# EAGLE schematic Longboard (EAGLE 9.1.3)

## Sheet 1 of 3
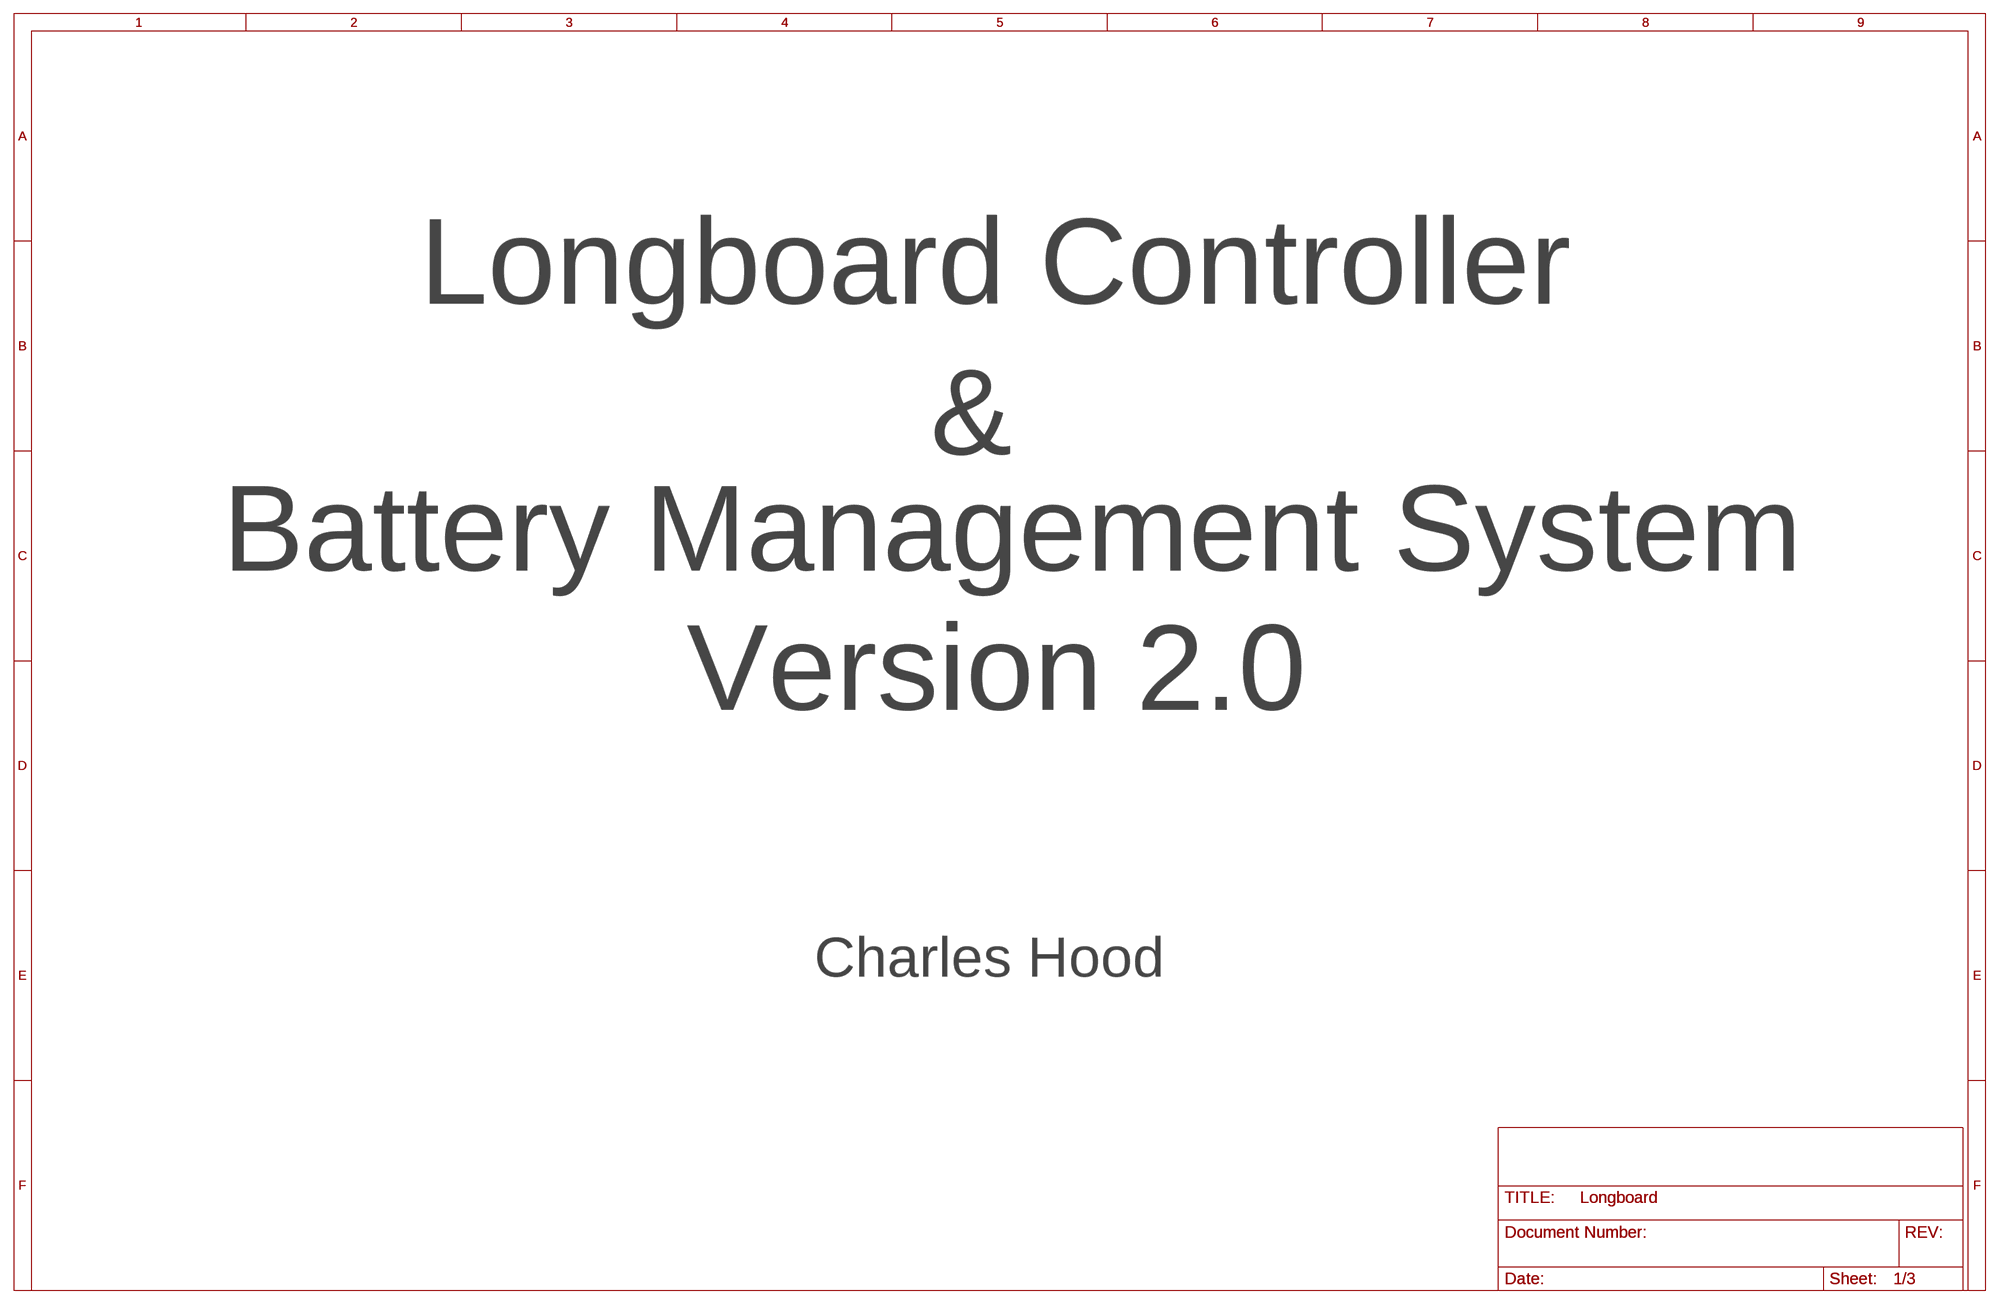
[diagram p0: schematic, sheet 1]

### Notes on the sheet
- Longboard Controller
- &
- Battery Management System
- Version 2.0
- Charles Hood

## Sheet 2 of 3
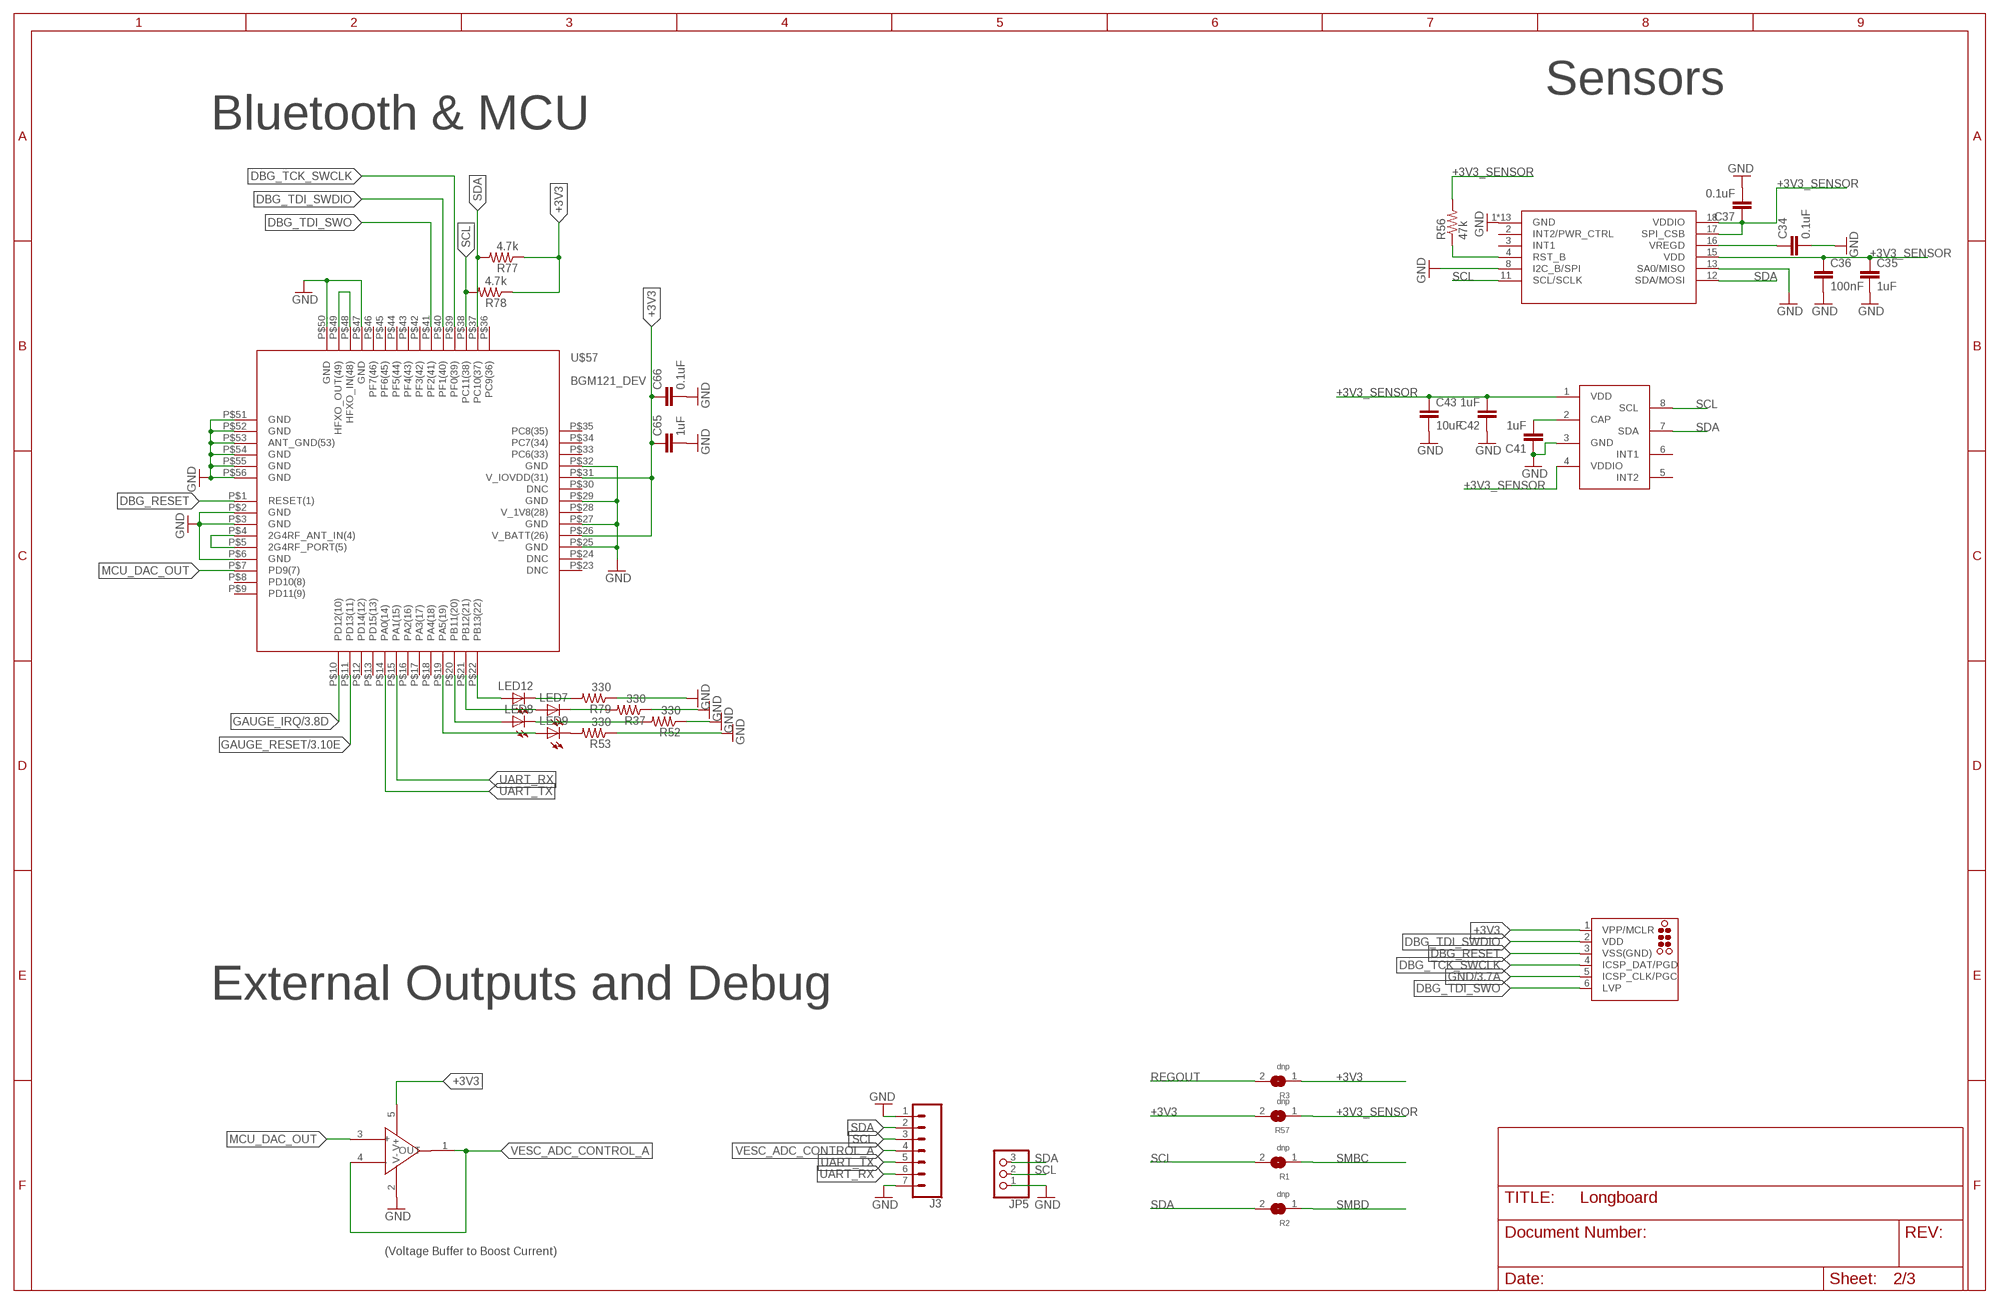
[diagram p1: schematic, sheet 2]

### Parts
C34  0.1uF  C-EUC0402  [C0402]
C35  1uF  C-EUC0402  [C0402]
C36  100nF  C-EUC0402  [C0402]
C37  0.1uF  C-EUC0402  [C0402]
C41  1uF  C-EUC0402  [C0402]
C42  1uF  C-EUC0402  [C0402]
C43  10uF  C-EUC0603  [C0603]
C65  1uF  C-EUC0402  [C0402]
C66  0.1uF  C-EUC0402  [C0402]
J2  TC2030-MCP-NL  [TC2030-MCP-NL]
J3  CONN_07  [1X07]
JP5  PINHD-1X3  [1X03]
LED7  LEDCHIP-LED0603  [CHIP-LED0603]
LED8  LEDCHIP-LED0603  [CHIP-LED0603]
LED9  LEDCHIP-LED0603  [CHIP-LED0603]
LED12  LEDCHIP-LED0603  [CHIP-LED0603]
R1  dnp  SOLDERJUMPER  [SOLDERJUMPER_ARROW_NOPASTE]
R2  dnp  SOLDERJUMPER  [SOLDERJUMPER_ARROW_NOPASTE]
R3  dnp  SOLDERJUMPER  [SOLDERJUMPER_ARROW_NOPASTE]
R37  330  R-US_R0402  [R0402]
R52  330  R-US_R0402  [R0402]
R53  330  R-US_R0402  [R0402]
R56  47k  R-US_R0402  [R0402]
R57  dnp  SOLDERJUMPER  [SOLDERJUMPER_ARROW_NOPASTE]
R77  4.7k  R-US_R0402  [R0402]
R78  4.7k  R-US_R0402  [R0402]
R79  330  R-US_R0402  [R0402]
U$5  MCP6001  [SOT23-5L]
U$25  MLP3115A2  [MLP3115A2]
U$34  FXAS21002  [FXAS21002]
U$57  BGM121_DEV  [BGM121_PAC]

### Nets
+3V3: C65.1 C66.1 J2.1(VPP/MCLR) R3.1 R57.2 R77.1 R78.1 U$5.5(V+) U$57.P$26(V_BATT(26)) U$57.P$31(V_IOVDD(31))
+3V3_SENSOR: C35.1 C36.1 C37.1 C42.2 C43.1 R56.2 R57.1 U$25.1(VDD) U$25.4(VDDIO) U$34.15(VDD) U$34.17(SPI_CSB) U$34.18(VDDIO)
DBG_RESET: J2.3(VSS(GND)) U$57.P$1(RESET(1))
DBG_TCK_SWCLK: J2.4(ICSP_DAT/PGD) U$57.P$39(PF0(39))
DBG_TDI_SWDIO: J2.2(VDD) U$57.P$40(PF1(40))
DBG_TDI_SWO: J2.6(LVP) U$57.P$41(PF2(41))
GAUGE_IRQ: U$57.P$10(PD12(10)) ; also sheet 3
GAUGE_RESET: U$57.P$11(PD13(11)) ; also sheet 3
GND: C34.2 C35.2 C36.2 C37.2 C41.1 C42.1 C43.2 C65.2 C66.2 J2.5(ICSP_CLK/PGC) J3.1 J3.7 JP5.1 R37.1 R52.1 R53.1 R79.1 U$5.2(V-) U$25.3(GND) U$34.1(GND) U$34.5(GND) U$34.6(GND) U$34.7(GND) U$34.9(GND) U$34.10(GND) U$34.13(SA0/MISO) U$34.14(GND) U$34.19(GND) U$34.20(GND) U$34.21(GND) U$34.22(GND) U$34.23(GND) U$34.24(GND) U$57.P$2(GND) U$57.P$3(GND) U$57.P$6(GND) U$57.P$25(GND) U$57.P$27(GND) U$57.P$29(GND) U$57.P$32(GND) U$57.P$47(GND) U$57.P$50(GND) U$57.P$51(GND) U$57.P$52(GND) U$57.P$53(ANT_GND(53)) U$57.P$54(GND) U$57.P$55(GND) U$57.P$56(GND) ; also sheet 3
MCU_DAC_OUT: U$5.3(+) U$57.P$7(PD9(7))
N$1: LED12.A U$57.P$22(PB13(22))
N$2: LED7.A U$57.P$21(PB12(21))
N$3: LED8.A U$57.P$20(PB11(20))
N$4: LED9.A U$57.P$19(PA5(19))
N$13: U$34.8(I2C_B/SPI) ; supply symbol labelled GND
N$30: R56.1 U$34.4(RST_B)
N$36: LED7.C R37.2
N$42: LED8.C R52.2
N$74: LED9.C R53.2
N$78: C34.1 U$34.16(VREGD)
N$81: C41.2 U$25.2(CAP)
N$110: U$57.P$4(2G4RF_ANT_IN(4)) U$57.P$5(2G4RF_PORT(5))
N$112: LED12.C R79.2
N$113: U$57.P$48(HFXO_IN(48)) U$57.P$49(HFXO_OUT(49))
REGOUT: R3.2 ; also sheet 3
SCL: J3.3 JP5.2 R1.2 R78.2 U$25.8(SCL) U$34.11(SCL/SCLK) U$57.P$38(PC11(38))
SDA: J3.2 JP5.3 R2.2 R77.2 U$25.7(SDA) U$34.12(SDA/MOSI) U$57.P$37(PC10(37))
SMBC: R1.1 ; also sheet 3
SMBD: R2.1 ; also sheet 3
UART_RX: J3.6 U$57.P$15(PA1(15))
UART_TX: J3.5 U$57.P$14(PA0(14))
VESC_ADC_CONTROL_A: J3.4 U$5.1(OUT) U$5.4(-)
Unconnected: U$25.5(INT2) U$25.6(INT1) U$34.2(INT2/PWR_CTRL) U$34.3(INT1) U$57.P$8(PD10(8)) U$57.P$9(PD11(9)) U$57.P$12(PD14(12)) U$57.P$13(PD15(13)) U$57.P$16(PA2(16)) U$57.P$17(PA3(17)) U$57.P$18(PA4(18)) U$57.P$23(DNC) U$57.P$24(DNC) U$57.P$30(DNC) U$57.P$33(PC6(33)) U$57.P$34(PC7(34)) U$57.P$35(PC8(35)) U$57.P$36(PC9(36)) U$57.P$42(PF3(42)) U$57.P$43(PF4(43)) U$57.P$44(PF5(44)) U$57.P$45(PF6(45)) U$57.P$46(PF7(46))

### Notes on the sheet
- Sensors
- Bluetooth & MCU
- External Outputs and Debug
- (Voltage Buffer to Boost Current)

## Sheet 3 of 3
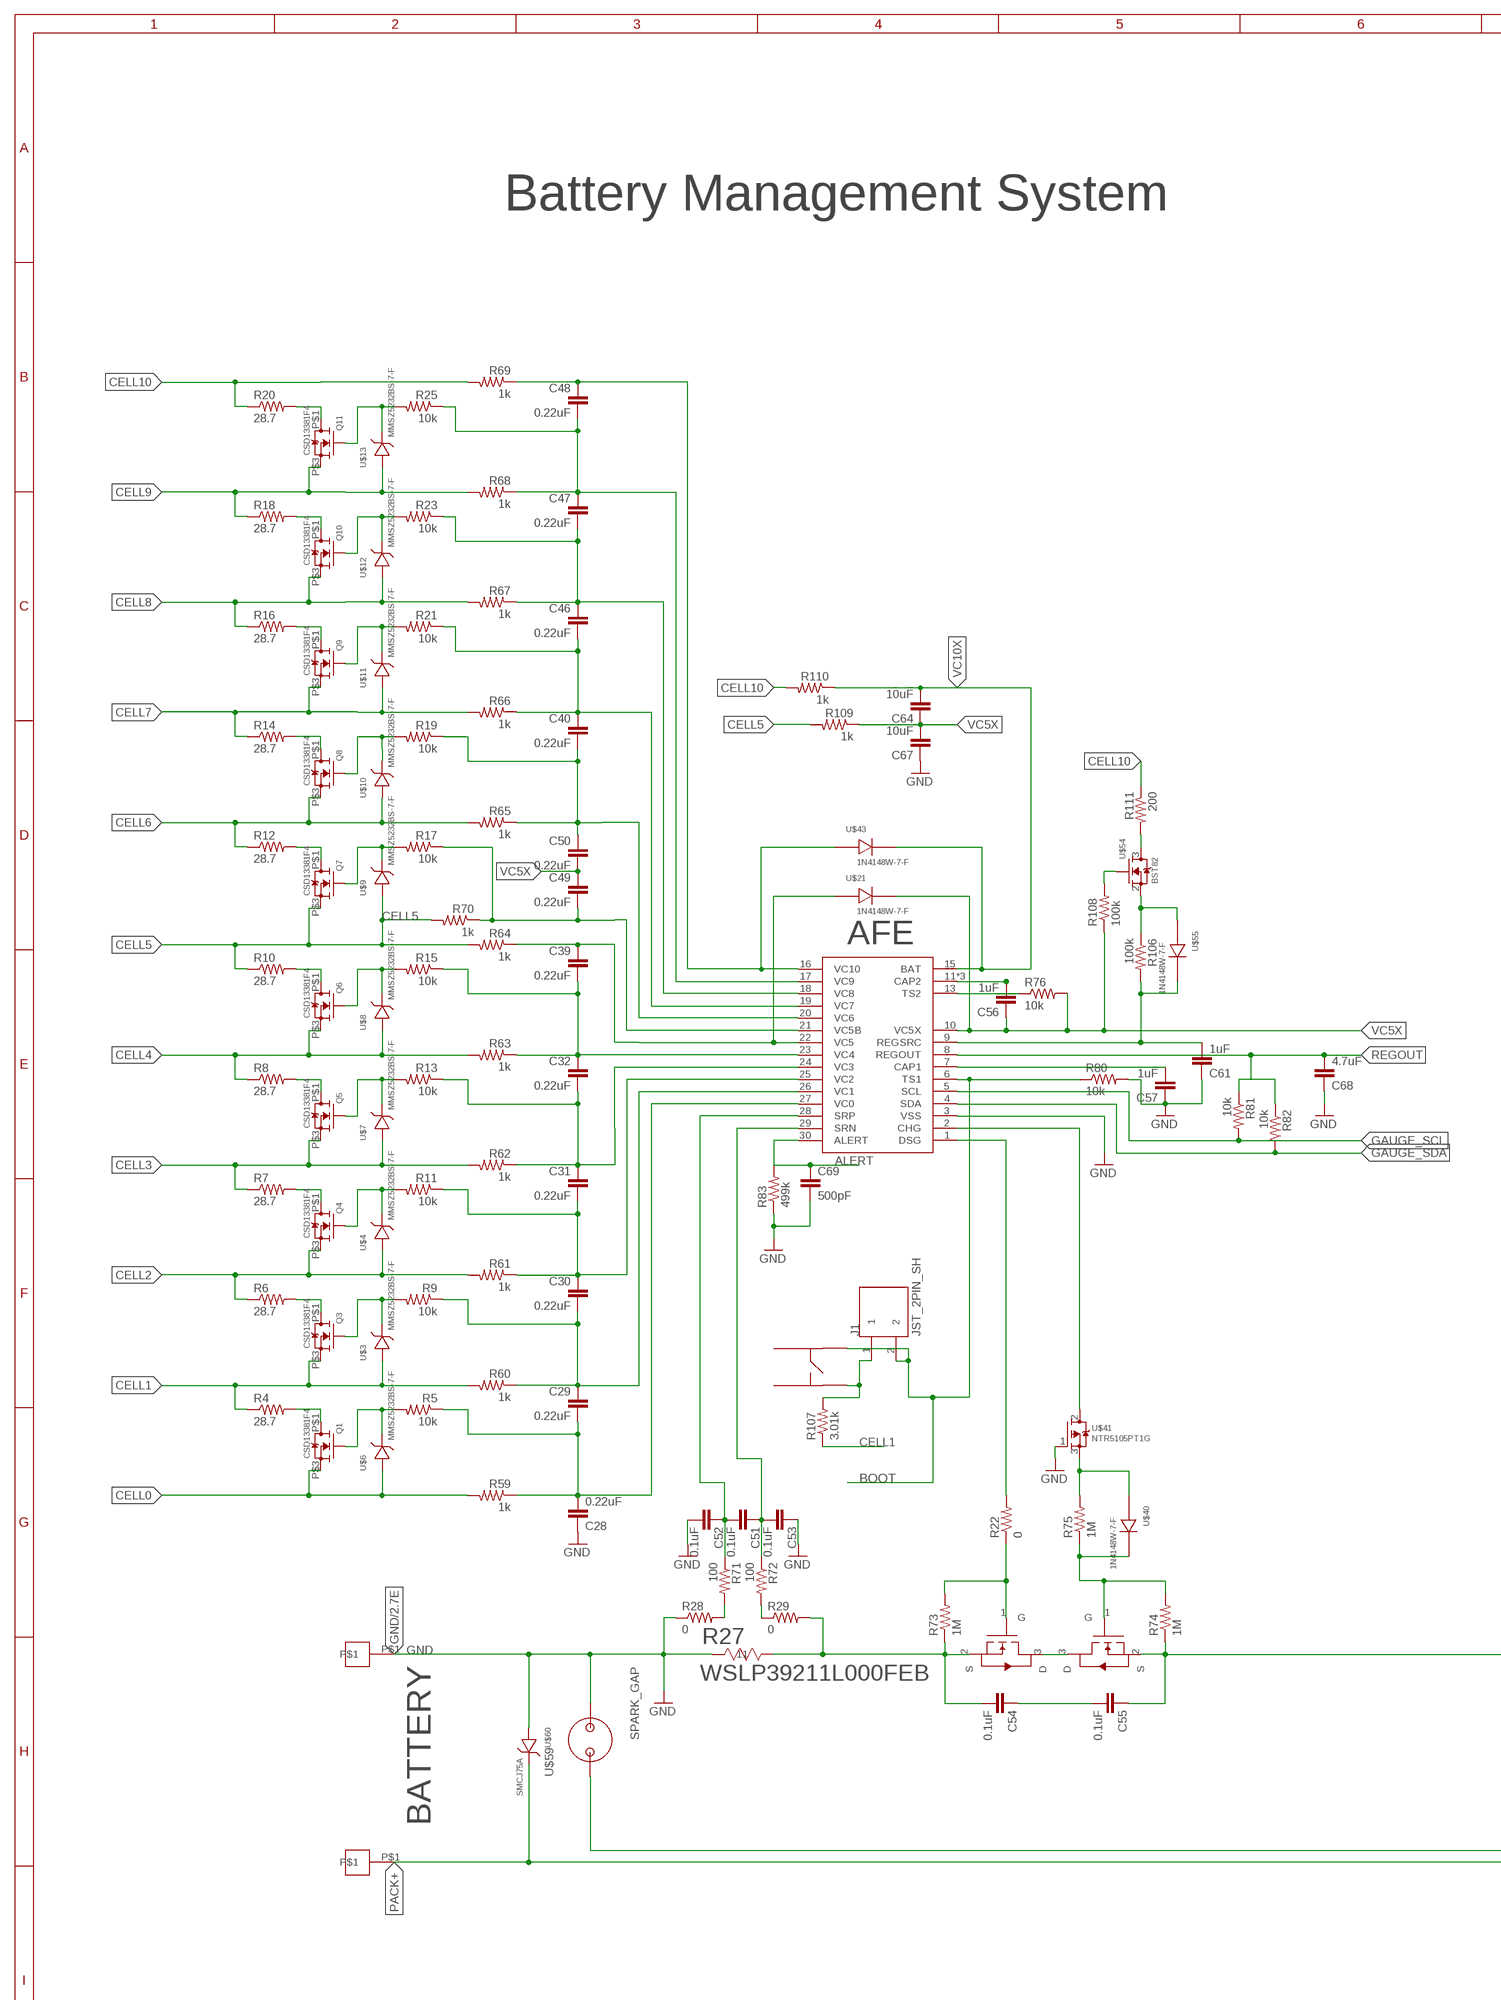
[diagram p2: schematic, sheet 3, part 1 of 2]
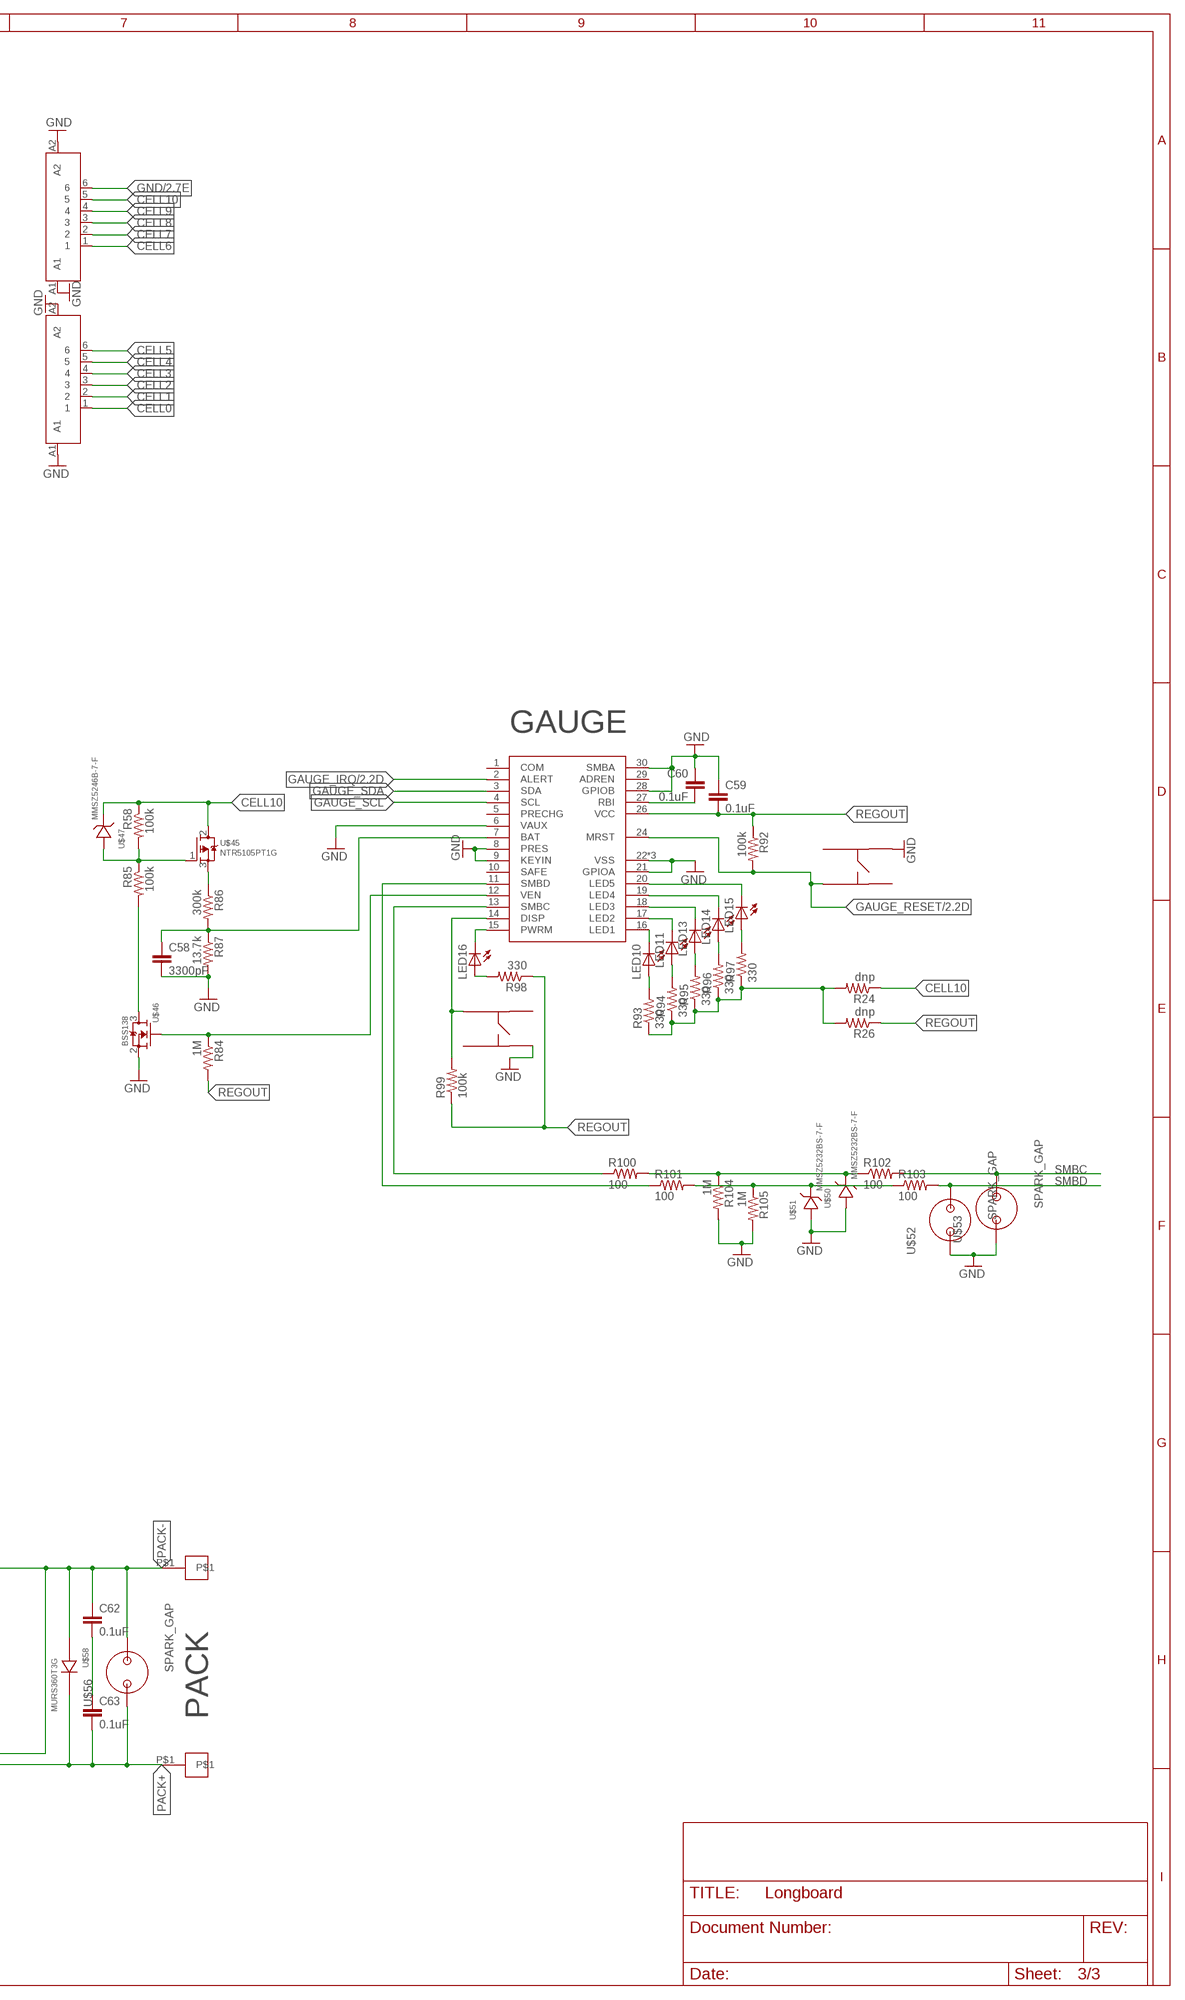
[diagram p3: schematic, sheet 3, part 2 of 2]

### Parts
C28  0.22uF  C-EUC0805  [C0805]
C29  0.22uF  C-EUC0805  [C0805]
C30  0.22uF  C-EUC0805  [C0805]
C31  0.22uF  C-EUC0805  [C0805]
C32  0.22uF  C-EUC0805  [C0805]
C39  0.22uF  C-EUC0805  [C0805]
C40  0.22uF  C-EUC0805  [C0805]
C46  0.22uF  C-EUC0805  [C0805]
C47  0.22uF  C-EUC0805  [C0805]
C48  0.22uF  C-EUC0805  [C0805]
C49  0.22uF  C-EUC0805  [C0805]
C50  0.22uF  C-EUC0805  [C0805]
C51  0.1uF  C-EUC0805  [C0805]
C52  0.1uF  C-EUC0805  [C0805]
C53  0.1uF  C-EUC0805  [C0805]
C54  0.1uF  C-EUC0805  [C0805]
C55  0.1uF  C-EUC0805  [C0805]
C56  1uF  C-EUC0805  [C0805]
C57  1uF  C-EUC0805  [C0805]
C58  3300pF  C-EUC0402  [C0402]
C59  0.1uF  C-EUC0805  [C0805]
C60  0.1uF  C-EUC0805  [C0805]
C61  1uF  C-EUC0805  [C0805]
C62  0.1uF  C-EUC0805  [C0805]
C63  0.1uF  C-EUC0805  [C0805]
C64  10uF  C-EUC1210  [C1210]
C67  10uF  C-EUC1210  [C1210]
C68  4.7uF  C-EUC0805  [C0805]
C69  500pF  C-EUC0603  [C0603]
J1  JST_2PIN_SH  [JST_2PIN_SH]
LED10  LEDCHIPLED_0603  [CHIPLED_0603]
LED11  LEDCHIPLED_0603  [CHIPLED_0603]
LED13  LEDCHIPLED_0603  [CHIPLED_0603]
LED14  LEDCHIPLED_0603  [CHIPLED_0603]
LED15  LEDCHIPLED_0603  [CHIPLED_0603]
LED16  LEDCHIPLED_0603  [CHIPLED_0603]
Q1  CSD13381F4  [3-XFDFN]
Q3  CSD13381F4  [3-XFDFN]
Q4  CSD13381F4  [3-XFDFN]
Q5  CSD13381F4  [3-XFDFN]
Q6  CSD13381F4  [3-XFDFN]
Q7  CSD13381F4  [3-XFDFN]
Q8  CSD13381F4  [3-XFDFN]
Q9  CSD13381F4  [3-XFDFN]
Q10  CSD13381F4  [3-XFDFN]
Q11  CSD13381F4  [3-XFDFN]
R4  28.7  R-US_R2010  [R2010]
R5  10k  R-US_R1206  [R1206]
R6  28.7  R-US_R2010  [R2010]
R7  28.7  R-US_R2010  [R2010]
R8  28.7  R-US_R2010  [R2010]
R9  10k  R-US_R1206  [R1206]
R10  28.7  R-US_R2010  [R2010]
R11  10k  R-US_R1206  [R1206]
R12  28.7  R-US_R2010  [R2010]
R13  10k  R-US_R1206  [R1206]
R14  28.7  R-US_R2010  [R2010]
R15  10k  R-US_R1206  [R1206]
R16  28.7  R-US_R2010  [R2010]
R17  10k  R-US_R1206  [R1206]
R18  28.7  R-US_R2010  [R2010]
R19  10k  R-US_R1206  [R1206]
R20  28.7  R-US_R2010  [R2010]
R21  10k  R-US_R1206  [R1206]
R22  0  R-US_R1206  [R1206]
R23  10k  R-US_R1206  [R1206]
R24  dnp  R-US_R0402  [R0402]
R25  10k  R-US_R1206  [R1206]
R26  dnp  R-US_R0402  [R0402]
R27  WSLP39211L000FEB  [W-3921]
R28  0  R-US_R0402  [R0402]
R29  0  R-US_R0402  [R0402]
R58  100k  R-US_R0805  [R0805]
R59  1k  R-US_R1206  [R1206]
R60  1k  R-US_R1206  [R1206]
R61  1k  R-US_R1206  [R1206]
R62  1k  R-US_R1206  [R1206]
R63  1k  R-US_R1206  [R1206]
R64  1k  R-US_R1206  [R1206]
R65  1k  R-US_R1206  [R1206]
R66  1k  R-US_R1206  [R1206]
R67  1k  R-US_R1206  [R1206]
R68  1k  R-US_R1206  [R1206]
R69  1k  R-US_R1206  [R1206]
R70  1k  R-US_R1206  [R1206]
R71  100  R-US_R0805  [R0805]
R72  100  R-US_R0805  [R0805]
R73  1M  R-US_R1206  [R1206]
R74  1M  R-US_R1206  [R1206]
R75  1M  R-US_R1206  [R1206]
R76  10k  R-US_R0805  [R0805]
R80  10k  R-US_R0805  [R0805]
R81  10k  R-US_R0805  [R0805]
R82  10k  R-US_R0805  [R0805]
R83  499k  R-US_R0603  [R0603]
R84  1M  R-US_R1206  [R1206]
R85  100k  R-US_R0805  [R0805]
R86  300k  R-US_R0805  [R0805]
R87  13.7k  R-US_R0805  [R0805]
R92  100k  R-US_R0805  [R0805]
R93  330  R-US_R0402  [R0402]
R94  330  R-US_R0402  [R0402]
R95  330  R-US_R0402  [R0402]
R96  330  R-US_R0402  [R0402]
R97  330  R-US_R0402  [R0402]
R98  330  R-US_R0402  [R0402]
R99  100k  R-US_R0402  [R0402]
R100  100  R-US_R0805  [R0805]
R101  100  R-US_R0805  [R0805]
R102  100  R-US_R0805  [R0805]
R103  100  R-US_R0805  [R0805]
R104  1M  R-US_R1206  [R1206]
R105  1M  R-US_R1206  [R1206]
R106  100k  R-US_R0805  [R0805]
R107  3.01k  R-US_R1206  [R1206]
R108  100k  R-US_R0805  [R0805]
R109  1k  R-US_R1206  [R1206]
R110  1k  R-US_R1206  [R1206]
R111  200  R-US_R1206  [R1206]
S1  KMR731NG  [KMR731NG]
S2  KMR731NG  [KMR731NG]
S3  KMR731NG  [KMR731NG]
U$3  MMSZ5232BS-7-F  [SOD-323F]
U$4  MMSZ5232BS-7-F  [SOD-323F]
U$6  MMSZ5232BS-7-F  [SOD-323F]
U$7  MMSZ5232BS-7-F  [SOD-323F]
U$8  MMSZ5232BS-7-F  [SOD-323F]
U$9  MMSZ5232BS-7-F  [SOD-323F]
U$10  MMSZ5232BS-7-F  [SOD-323F]
U$11  MMSZ5232BS-7-F  [SOD-323F]
U$12  MMSZ5232BS-7-F  [SOD-323F]
U$13  MMSZ5232BS-7-F  [SOD-323F]
U$14  PAD  [PAD]
U$15  PAD  [PAD]
U$16  PAD  [PAD]
U$17  PAD  [PAD]
U$18  JST_6PIN  [JST_6PIN]
U$19  JST_6PIN  [JST_6PIN]
U$20  BQ76930  [SOIC-30]
U$21  1N4148W-7-F  [SOD-123]
U$22  AOB290L  [TO-263]
U$23  AOB290L  [TO-263]
U$40  1N4148W-7-F  [SOD-123]
U$41  NTR5105PT1G  BSS84PH6433XTMA1  [SOT23-3]
U$43  1N4148W-7-F  [SOD-123]
U$44  BQ78350-R1  [SOIC-30]
U$45  NTR5105PT1G  BSS84PH6433XTMA1  [SOT23-3]
U$46  BSS138  [SOT23-3]
U$47  MMSZ5246B-7-F  [SOD-123]
U$50  MMSZ5232BS-7-F  [SOD-323F]
U$51  MMSZ5232BS-7-F  [SOD-323F]
U$52  SPARK_GAP  [SPARK_GAP]
U$53  SPARK_GAP  [SPARK_GAP]
U$54  BST82  [SOT23-3]
U$55  1N4148W-7-F  [SOD-123]
U$56  SPARK_GAP  [SPARK_GAP]
U$58  MURS360T3G  [SMC(DO-214AB)]
U$59  SPARK_GAP  [SPARK_GAP]
U$60  SMCJ75A  SMCJ28A  [SMC(DO-214AB)]

### Nets
ALERT: C69.1 R83.2 U$20.30(ALERT)
BOOT: J1.2 R80.1 S1.P$2 U$20.6(TS1)
CELL0: Q1.P$3(S) R59.2 U$6.1 U$19.1
CELL1: Q3.P$3(S) R4.1 R60.2 R107.1 U$3.1 U$19.2
CELL2: Q4.P$3(S) R6.1 R61.2 U$4.1 U$19.3
CELL3: Q5.P$3(S) R7.1 R62.2 U$7.1 U$19.4
CELL4: Q6.P$3(S) R8.1 R63.2 U$8.1 U$19.5
CELL5: Q7.P$3(S) R10.1 R64.2 R70.2 R109.2 U$9.1 U$19.6
CELL6: Q8.P$3(S) R12.1 R65.2 U$10.1 U$18.1
CELL7: Q9.P$3(S) R14.1 R66.2 U$11.1 U$18.2
CELL8: Q10.P$3(S) R16.1 R67.2 U$12.1 U$18.3
CELL9: Q11.P$3(S) R18.1 R68.2 U$13.1 U$18.4
CELL10: R20.1 R24.1 R58.1 R69.2 R110.2 R111.1 U$18.5 U$45.2(S) U$47.P$2
GAUGE_IRQ: U$44.2(ALERT) ; also sheet 2
GAUGE_RESET: R92.2 S3.P$4 U$44.24(MRST) ; also sheet 2
GAUGE_SCL: R81.2 U$20.5(SCL) U$44.4(SCL)
GAUGE_SDA: R82.2 U$20.4(SDA) U$44.3(SDA)
GND: C28.1 C52.2 C53.1 C57.1 C58.2 C59.1 C60.1 C61.1 C67.1 C68.1 C69.2 R27.1 R28.1 R80.2 R83.1 R87.2 R104.2 R105.2 S2.P$3 S3.P$2 U$17.P$1 U$18.6 U$18.A1 U$18.A2 U$19.A1 U$19.A2 U$20.3(VSS) U$41.1(G) U$44.6(VAUX) U$44.8(PRES) U$44.9(KEYIN) U$44.21(GPIOA) U$44.22(VSS) U$44.23(VSS) U$44.25(VSS) U$44.28(GPIOB) U$44.30(SMBA) U$46.2(S) U$50.1 U$51.1 U$52.P$1 U$53.P$1 U$59.P$2 U$60.1 ; also sheet 2
N$5: R28.2 R71.2
N$6: R29.1 R72.2
N$7: Q1.P$1(D) R4.2
N$8: Q8.P$2(G) R19.2 U$10.2
N$9: Q1.P$2(G) R5.2 U$6.2
N$10: Q3.P$1(D) R6.2
N$11: Q3.P$2(G) R9.2 U$3.2
N$12: R22.2 U$20.1(DSG)
N$14: Q5.P$1(D) R8.2
N$15: Q4.P$1(D) R7.2
N$16: Q4.P$2(G) R11.2 U$4.2
N$17: Q5.P$2(G) R13.2 U$7.2
N$18: Q6.P$2(G) R15.2 U$8.2
N$19: Q8.P$1(D) R14.2
N$20: C40.2 C50.1 R19.1 R65.1 U$20.20(VC6)
N$21: C49.2 R17.1 R70.1 U$20.21(VC5B)
N$22: R24.2 R26.2 R93.1 R94.1 R95.1 R96.1 R97.1
N$23: Q6.P$1(D) R10.2
N$26: Q7.P$1(D) R12.2
N$27: Q7.P$2(G) R17.2 U$9.2
N$28: Q9.P$1(D) R16.2
N$32: Q10.P$1(D) R18.2
N$33: Q11.P$1(D) R20.2
N$34: Q11.P$2(G) R25.2 U$13.2
N$35: Q10.P$2(G) R23.2 U$12.2
N$37: Q9.P$2(G) R21.2 U$11.2
N$75: C29.1 C30.2 R9.1 R60.1 U$20.26(VC1)
N$76: C30.1 C31.2 R11.1 R61.1 U$20.25(VC2)
N$77: C31.1 C32.2 R13.1 R62.1 U$20.24(VC3)
N$79: C32.1 C39.2 R15.1 R63.1 U$20.23(VC4)
N$80: C39.1 R64.1 U$20.22(VC5) U$21.P$1
N$82: C40.1 C46.2 R21.1 R66.1 U$20.19(VC7)
N$83: C46.1 C47.2 R23.1 R67.1 U$20.18(VC8)
N$84: C47.1 C48.2 R25.1 R68.1 U$20.17(VC9)
N$85: C48.1 R69.1 U$20.16(VC10) U$43.P$1
N$86: C28.2 C29.2 R5.1 R59.1 U$20.27(VC0)
N$97: C51.1 C53.2 R72.1 U$20.29(SRN)
N$98: C51.2 C52.1 R71.1 U$20.28(SRP)
N$99: C54.2 R27.2 R29.2 R73.1 U$22.2(S)
N$100: U$22.3(D) U$23.3(D)
N$101: R74.2 R75.1 U$23.1(G) U$40.P$2
N$102: R75.2 U$40.P$1 U$41.3(D)
N$103: U$20.2(CHG) U$41.2(S)
N$104: C54.1 C55.2
N$105: C56.2 U$20.11(CAP2) U$20.12(CAP2) U$20.14(CAP2)
N$106: R76.1 U$20.13(TS2)
N$107: C57.2 U$20.7(CAP1)
N$108: R84.1 U$44.12(VEN) U$46.1(G)
N$109: R85.2 U$46.3(D)
N$114: R58.2 R85.1 U$45.1(G) U$47.P$1
N$115: R86.1 U$45.3(D)
N$116: C58.1 R86.2 R87.1 U$44.7(BAT)
N$122: C60.2 U$44.27(RBI)
N$124: LED10.A R93.2
N$125: LED11.A R94.2
N$126: LED13.A R95.2
N$127: LED14.A R96.2
N$128: LED15.A R97.2
N$129: LED10.C U$44.16(LED1)
N$130: LED11.C U$44.17(LED2)
N$131: LED13.C U$44.18(LED3)
N$132: LED14.C U$44.19(LED4)
N$133: LED15.C U$44.20(LED5)
N$134: LED16.A R98.2
N$135: R99.2 S2.P$1 U$44.14(DISP)
N$136: LED16.C U$44.15(PWRM)
N$138: R101.1 U$44.11(SMBD)
N$139: R100.1 U$44.13(SMBC)
N$140: R100.2 R102.1 R104.1 U$50.2
N$141: R101.2 R103.1 R105.1 U$51.2
N$142: R106.1 U$54.2(S) U$55.P$1
N$143: R111.2 U$54.3(D)
N$144: R22.1 R73.2 U$22.1(G)
N$145: J1.1 R107.2 S1.P$3
N$146: C62.2 C63.1
N$147: R108.2 U$54.1(G)
PACK+: C63.2 U$15.P$1 U$16.P$1 U$56.P$1 U$58.2 U$60.2
PACK-: C55.1 C62.1 R74.1 U$14.P$1 U$23.2(S) U$56.P$2 U$58.1 U$59.P$1
REGOUT: C59.2 C68.2 R26.1 R81.1 R82.1 R84.2 R92.1 R98.1 R99.1 U$20.8(REGOUT) U$44.26(VCC) ; also sheet 2
REGSRC: C61.2 R106.2 U$20.9(REGSRC) U$55.P$2
SMBC: R102.2 U$53.P$2 ; also sheet 2
SMBD: R103.2 U$52.P$2 ; also sheet 2
VC5X: C49.1 C50.2 C56.1 C64.1 C67.2 R76.2 R108.1 R109.1 U$20.10(VC5X) U$21.P$2
VC10X: C64.2 R110.1 U$20.15(BAT) U$43.P$2
Unconnected: S1.P$1 S1.P$4 S2.P$2 S2.P$4 S3.P$1 S3.P$3 U$44.1(COM) U$44.5(PRECHG) U$44.10(SAFE) U$44.29(ADREN)

### Notes on the sheet
- Battery Management System
- GAUGE
- AFE
- PACK
- BATTERY

## Power pins joined to a net without a drawn wire
V_1V8(28): U$57.P$28(V_1V8(28))

## Library data of the parts
C28-C32 C34-C37 C39-C43 C46-C64 C67-C69 = rcl:C-EU: CAPACITOR, European symbol
C65 C66 = rcl:C-EU: CAPACITOR, European symbol; SPICEPREFIX: C
J1 = James_Updated:JST_2PIN_SH: 1mm pitch SMD 2 pin Right Angle JST Header / Connector. Typically used for battery connectors. https://www.digikey.com/product-detail/en/jst-sales-america-inc/SM02B-SRSS-TB-LF-SN/455-1802-1-ND/926873
J2 = Tag-Connect-Footprints:TC2030: TAG-CONNECT ICSP Connector Manufacturer: Tag-Connect <http://www.tag-connect.com> Cable for easy In-Circuit Serial Programming. Designed for Microchip ICD2, suitable for many others. Two variants - one "with legs" (for hands-free fit on PCB) and another "without legs" for quick programming. PAD Description 1 MCLR/Vpp 2 Vdd 3 GND 4 PGD (ISPDAT) 5 PGC (ISPCLK) 6 nc (used for LVP) ©2009 ROFA.cz - modified and updated by Robert Darlington ‹rdarlington@gmail.com›
J3 = SparkFun-Connectors:CONN_07: Multi connection point. Often used as Generic Header-pin footprint for 0.1 inch spaced/style header connections On any of the 0.1 inch spaced packages, you can populate with these: Break Away Headers - Straight <https://www.sparkfun.com/products/116> (PRT-00116) Break Away Male Headers - Right Angle <https://www.sparkfun.com/products/553> (PRT-00553) Female Headers <https://www.sparkfun.com/products/115> (PRT-00115) Break Away Headers - Machine Pin <https://www.sparkfun.com/products/117> (PRT-00117) Break Away Female Headers - Swiss Machine Pin <https://www.sparkfun.com/products/743> (PRT-00743) For SCREWTERMINALS and SPRING TERMINALS visit here: Screw Terimnals on SparkFun.com <https://www.sparkfun.com/search/results?term=Screw+Terminals> (5mm/3.5mm/2.54mm spacing) This device is also useful as a general connection point to wire up your design to another part of your project. Our various solder wires solder well into these plated through hole pads. Hook-Up Wire - Assortment (Stranded, 22 AWG) <https://www.sparkfun.com/products/11375> (PRT-11375) Hook-Up Wire - Assortment (Solid Core, 22 AWG) <https://www.sparkfun.com/products/11367> (PRT-11367) View the entire wire category on our website here <https://www.sparkfun.com/categories/141> Special notes: Molex polarized connector foot print use with SKU : PRT-08231 with associated crimp pins and housings. 1MM SMD Version SKU: PRT-10208 NOTES ON THE VARIANTS LOCK and LOCK_LONGPADS... This footprint was designed to help hold the alignment of a through-hole component (i.e. 6-pin header) while soldering it into place. You may notice that each hole has been shifted either up or down by 0.005 of an inch from it's more standard position (which is a perfectly straight line). This slight alteration caused the pins (the squares in the middle) to touch the edges of the holes. Because they are alternating, it causes a "brace" to hold the component in place. 0.005 has proven to be the perfect amount of "off-center" position when using our standard breakaway headers. Although looks a little odd when you look at the bare footprint, once you have a header in there, the alteration is very hard to notice. Also,if you push a header all the way into place, it is covered up entirely on the bottom side.
JP5 = pinhead:PINHD-1X3: PIN HEADER
LED7-LED16 = adafruit:LED: LED OSRAM: - CHIPLED LG R971, LG N971, LY N971, LG Q971, LY Q971, LO R971, LY R971 LH N974, LH R974 LS Q976, LO Q976, LY Q976 LO Q996 - Hyper CHIPLED LW Q18S LB Q993, LB Q99A, LB R99A - SideLED LS A670, LO A670, LY A670, LG A670, LP A670 LB A673, LV A673, LT A673, LW A673 LH A674 LY A675 LS A676, LA A676, LO A676, LY A676, LW A676 LS A679, LY A679, LG A679 - Hyper Micro SIDELED® LS Y876, LA Y876, LO Y876, LY Y876 LT Y87S - SmartLED LW L88C, LW L88S LB L89C, LB L89S, LG L890 LS L89K, LO L89K, LY L89K LS L896, LA L896, LO L896, LY L896 - TOPLED LS T670, LO T670, LY T670, LG T670, LP T670 LSG T670, LSP T670, LSY T670, LOP T670, LYG T670 LG T671, LOG T671, LSG T671 LB T673, LV T673, LT T673, LW T673 LH T674 LS T676, LA T676, LO T676, LY T676, LB T676, LH T676, LSB T676, LW T676 LB T67C, LV T67C, LT T67C, LS T67K, LO T67K, LY T67K, LW E67C LS E67B, LA E67B, LO E67B, LY E67B, LB E67C, LV E67C, LT E67C LW T67C LS T679, LY T679, LG T679 LS T770, LO T770, LY T770, LG T770, LP T770 LB T773, LV T773, LT T773, LW T773 LH T774 LS E675, LA E675, LY E675, LS T675 LS T776, LA T776, LO T776, LY T776, LB T776 LHGB T686 LT T68C, LB T68C - Hyper Mini TOPLED® LB M676 - Mini TOPLED Santana® LG M470 LS M47K, LO M47K, LY M47K Source: http://www.osram.convergy.de/
Q1 Q3-Q11 = Charles:CSD13381F4: CSD13381F412VN-Channel FemtoFET MOSFET (ID 2.1A, IDM 7A)
R1-R3 R57 = Charles:SOLDERJUMPER: SMD Solder JUMPER Solder the two pads together to create a connection, or remove the solder to break it. REFLOW - Use this footprint for solder paste and reflow ovens. WAVE - Use this footprint for hand-soldering (larger pads). CLOSED - Has a trace between the two pads to ensure it is closed by default. The trace needs to be cut to disable the jumper, and can be closed again by creating a solder bridge between the two pads.; BOM: EXCLUDE
R4 R6-R8 R10 R12 R14 R16 R18 R20 = resistor:R-US_: RESISTOR, American symbol
R5 R9 R11 R13 R15 R17 R19 R21-R26 R56 R58-R76 R80-R87 R92-R111 = rcl:R-US_: RESISTOR, American symbol
R27 = Charles:WSLP39211L000FEB: RES 0.001 OHM 1% 9W 3921; MANUFACTURER_PART_NUMBER: WSLP39211L000FEB; VENDOR: Vishay
R28 R29 R37 R52 R53 R77-R79 = rcl:R-US_: RESISTOR, American symbol; SPICEPREFIX: R
S1-S3 = Charles:KMR731NG: Tactile Switch SPST-NO Top Actuated Surface Mount
U$3 U$4 U$6-U$13 U$50 U$51 = Charles:MMSZ5232BS-7-F: ZENER DIODE 5.6V 200MW
U$5 = James_Updated:MCP6001
U$14-U$17 = Charles:PAD
U$18 U$19 = James_Updated:JST_6PIN
U$20 = Charles:BQ76930
U$21 U$40 U$43 U$55 = Charles:1N4148W-7-F: DIODE GENERAL PURPOSE 100V 300MA
U$22 U$23 = Charles:AOB290L
U$25 = Charles:MLP3115A2: I2C Precision Altimeter
U$34 = Charles:FXAS21002: 3-Axis Digital Angular Rate Gyroscope (I2C/SPI)
U$41 U$45 = Charles:BSS84PH6433XTMA1: MOSFET P-Channel 60V 170MA SOT-23
U$44 = Charles:BQ78350-R1
U$46 = Charles:BSS138: MOSFET N-CH 50V 220MA
U$47 = Charles:MMSZ5246B-7-F: ZENER DIODE 16V 500MW
U$52 U$53 U$56 U$59 = Charles:SPARK_GAP: Spark Gap 0.2mm ~2kV for ESD Protection
U$54 = Charles:BST82: MOSFET N-CH 50V 220MA
U$57 = BGM121:BGM121_DEV: BGM121 - Blue Gecko BGM111 Bluetooth Smart® SiP Module Technical Specifications: Bluetooth 4.2 compliant Configurable TX power up to +8 dBm Range up to 200 meters ARM® Cortex-M4 @ up to 38.4 MHz Arrow: BGM121A256V1 <https://www.arrow.com/en/products/search?q=bgm121> Digikey: 336-3811-1-ND <https://www.digikey.com/product-search/en/rf-if-and-rfid/rf-transceiver-modules/3539948?k=bgm121> Mouser: 634-BGM121A256V1 <http://www.mouser.com/Search/Refine.aspx?Keyword=bgm121>
U$58 = Charles:MURS360T3G: Ultrafast Power Rectifier, Diode General Purpose 600V 3A
U$60 = Charles:SMCJ28A: Zener Diode - 1500 Watt Transient Voltage Suppressor - 28VWM 45.4VC - Fairchild-Semiconductor

## Net classes
0 default: width 0.152 mm, drill 0.305 mm, clearance 0.152 mm
1 power: width 0.203 mm, drill 0.305 mm, clearance 0.152 mm